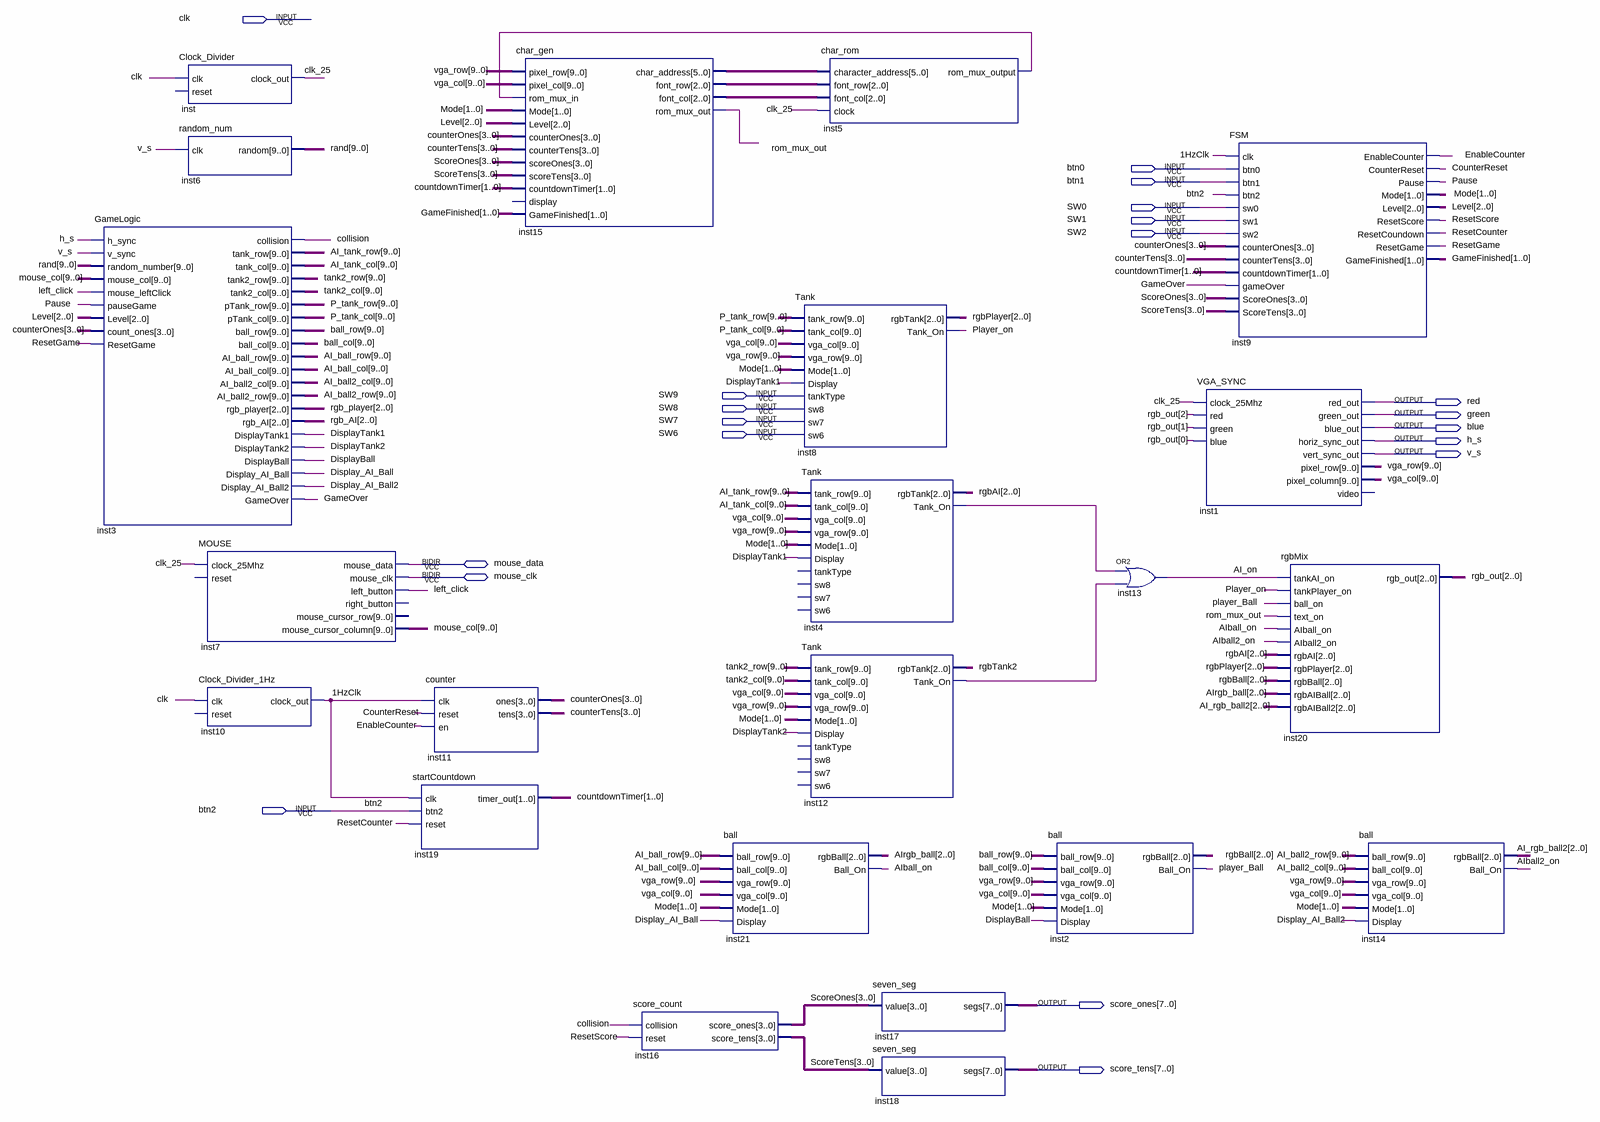
[diagram p0: schematic sheet]
// Quartus schematic prototype.bdf as structural Verilog: 22 symbols, 20 pins
module prototype (
  input  clk,
  input  btn0,
  input  btn1,
  input  SW0,
  input  SW1,
  input  SW2,
  input  SW9,
  input  SW8,
  input  SW7,
  input  SW6,
  input  btn2,
  inout  mouse_data,
  inout  mouse_clk,
  output red,
  output green,
  output blue,
  output h_s,
  output v_s,
  output [7:0] score_ones,
  output [7:0] score_tens
);

  wire \1HzClk , AI_on, AIball2_on, AIball_on, clk_25, collision, CounterReset, Display_AI_Ball,
       Display_AI_Ball2, DisplayBall, DisplayTank1, DisplayTank2, EnableCounter, GameOver, inst4_tank_on,
       inst5_rom_mux_output, inst12_tank_on, left_click, Pause, player_Ball, Player_on, ResetCounter,
       ResetGame, ResetScore, rgbTank2, rom_mux_out;
  wire [1:0] countdownTimer, GameFinished, Mode;
  wire [2:0] AI_rgb_ball2, AIrgb_ball, inst15_font_col, inst15_font_row, Level, rgb_AI, rgb_out, rgb_player,
       rgbAI, rgbBall, rgbPlayer;
  wire [3:0] counterOnes, counterTens, ScoreOnes, ScoreTens;
  wire [5:0] inst15_char_address;
  wire [9:0] AI_ball2_col, AI_ball2_row, AI_ball_col, AI_ball_row, AI_tank_col, AI_tank_row, ball_col,
       ball_row, mouse_col, P_tank_col, P_tank_row, \rand , tank2_col, tank2_row, vga_col, vga_row;

  GameLogic inst3 (
    .h_sync(h_s), .v_sync(v_s), .random_number(\rand ), .mouse_col(mouse_col), .mouse_leftClick(left_click),
    .pauseGame(Pause), .Level(Level), .count_ones(counterOnes), .ResetGame(ResetGame), .collision(collision),
    .tank_row(AI_tank_row), .tank_col(AI_tank_col), .tank2_row(tank2_row), .tank2_col(tank2_col),
    .pTank_row(P_tank_row), .pTank_col(P_tank_col), .ball_row(ball_row), .ball_col(ball_col),
    .AI_ball_row(AI_ball_row), .AI_ball_col(AI_ball_col), .AI_ball2_col(AI_ball2_col),
    .AI_ball2_row(AI_ball2_row), .rgb_player(rgb_player), .rgb_AI(rgb_AI), .DisplayTank1(DisplayTank1),
    .DisplayTank2(DisplayTank2), .DisplayBall(DisplayBall), .Display_AI_Ball(Display_AI_Ball),
    .Display_AI_Ball2(Display_AI_Ball2), .GameOver(GameOver));
  Clock_Divider inst (.clk(clk), .clock_out(clk_25));  // open: reset
  random_num inst6 (.clk(v_s), .random(\rand ));
  MOUSE inst7 (
    .clock_25Mhz(clk_25), .left_button(left_click), .mouse_cursor_column(mouse_col), .mouse_data(mouse_data),
    .mouse_clk(mouse_clk));  // open: reset, right_button, mouse_cursor_row
  Clock_Divider_1Hz inst10 (.clk(clk), .clock_out(\1HzClk ));  // open: reset
  counter inst11 (.clk(\1HzClk ), .reset(CounterReset), .en(EnableCounter), .ones(counterOnes), .tens(counterTens));
  startCountdown inst19 (.clk(\1HzClk ), .btn2(btn2), .reset(ResetCounter), .timer_out(countdownTimer));
  char_gen inst15 (
    .pixel_row(vga_row), .pixel_col(vga_col), .rom_mux_in(inst5_rom_mux_output), .Mode(Mode), .Level(Level),
    .counterOnes(counterOnes), .counterTens(counterTens), .scoreOnes(ScoreOnes), .scoreTens(ScoreTens),
    .countdownTimer(countdownTimer), .GameFinished(GameFinished), .char_address(inst15_char_address),
    .font_row(inst15_font_row), .font_col(inst15_font_col), .rom_mux_out(rom_mux_out));  // open: display
  score_count inst16 (.collision(collision), .reset(ResetScore), .score_ones(ScoreOnes), .score_tens(ScoreTens));
  ball inst21 (
    .ball_row(AI_ball_row), .ball_col(AI_ball_col), .vga_row(vga_row), .vga_col(vga_col), .Mode(Mode),
    .Display(Display_AI_Ball), .rgbBall(AIrgb_ball), .Ball_On(AIball_on));
  Tank inst8 (
    .tank_row(P_tank_row), .tank_col(P_tank_col), .vga_col(vga_col), .vga_row(vga_row), .Mode(Mode),
    .Display(DisplayTank1), .tankType(SW9), .sw8(SW8), .sw7(SW7), .sw6(SW6), .rgbTank(rgbPlayer),
    .Tank_On(Player_on));
  char_rom inst5 (
    .character_address(inst15_char_address), .font_row(inst15_font_row), .font_col(inst15_font_col),
    .clock(clk_25), .rom_mux_output(inst5_rom_mux_output));
  Tank inst4 (
    .tank_row(AI_tank_row), .tank_col(AI_tank_col), .vga_col(vga_col), .vga_row(vga_row), .Mode(Mode),
    .Display(DisplayTank1), .rgbTank(rgbAI), .Tank_On(inst4_tank_on));  // open: tankType, sw8, sw7, sw6
  Tank inst12 (
    .tank_row(tank2_row), .tank_col(tank2_col), .vga_col(vga_col), .vga_row(vga_row), .Mode(Mode),
    .Display(DisplayTank2), .rgbTank(rgbTank2), .Tank_On(inst12_tank_on));  // open: tankType, sw8, sw7, sw6
  seven_seg inst17 (.value(ScoreOnes), .segs(score_ones));
  seven_seg inst18 (.value(ScoreTens), .segs(score_tens));
  ball inst2 (
    .ball_row(ball_row), .ball_col(ball_col), .vga_row(vga_row), .vga_col(vga_col), .Mode(Mode),
    .Display(DisplayBall), .rgbBall(rgbBall), .Ball_On(player_Ball));
  or inst13 (AI_on, inst4_tank_on, inst12_tank_on);
  VGA_SYNC inst1 (
    .clock_25Mhz(clk_25), .red(rgb_out[2]), .green(rgb_out[1]), .blue(rgb_out[0]), .red_out(red),
    .green_out(green), .blue_out(blue), .horiz_sync_out(h_s), .vert_sync_out(v_s), .pixel_row(vga_row),
    .pixel_column(vga_col));  // open: video
  FSM inst9 (
    .clk(\1HzClk ), .btn0(btn0), .btn1(btn1), .btn2(btn2), .sw0(SW0), .sw1(SW1), .sw2(SW2),
    .counterOnes(counterOnes), .counterTens(counterTens), .countdownTimer(countdownTimer),
    .gameOver(GameOver), .ScoreOnes(ScoreOnes), .ScoreTens(ScoreTens), .EnableCounter(EnableCounter),
    .CounterReset(CounterReset), .Pause(Pause), .Mode(Mode), .Level(Level), .ResetScore(ResetScore),
    .ResetCoundown(ResetCounter), .ResetGame(ResetGame), .GameFinished(GameFinished));
  rgbMix inst20 (
    .tankAI_on(AI_on), .tankPlayer_on(Player_on), .ball_on(player_Ball), .text_on(rom_mux_out),
    .AIball_on(AIball_on), .AIball2_on(AIball2_on), .rgbAI(rgbAI), .rgbPlayer(rgbPlayer), .rgbBall(rgbBall),
    .rgbAIBall(AIrgb_ball), .rgbAIBall2(AI_rgb_ball2), .rgb_out(rgb_out));
  ball inst14 (
    .ball_row(AI_ball2_row), .ball_col(AI_ball2_col), .vga_row(vga_row), .vga_col(vga_col), .Mode(Mode),
    .Display(Display_AI_Ball2), .rgbBall(AI_rgb_ball2), .Ball_On(AIball2_on));
endmodule
